# Altium schematic sheet MCU.SchDoc
size A4; SheetNumber: 2; SheetTotal: 6
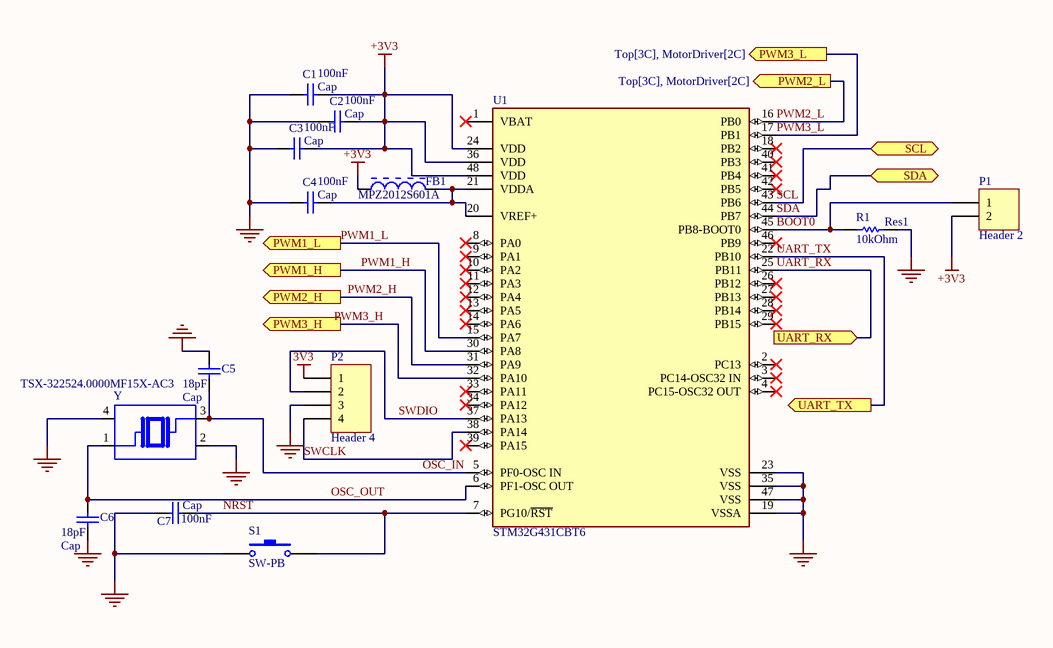
[diagram p0: MCU.SchDoc]

## Parts
C1  Cap  value 100nF  [RAD-0.3]
C2  Cap  value 100nF  [RAD-0.3]
C3  Cap  value 100nF  [RAD-0.3]
C4  Cap  value 100nF  [RAD-0.3]
C5  Cap  value 18pF  [RAD-0.3]
C6  Cap  value 18pF  [RAD-0.3]
C7  Cap  value 100nF  [RAD-0.3]
FB1  MPZ2012S601A  [TDK-MPZ2012_V]
P1  Header 2  [HDR1X2]
P2  Header 4  [HDR1X4]
R1  Res1  value 10kOhm  [AXIAL-0.3]
S1  SW-PB  [SPST-2]
U1  STM32G431CBT6  [FP-LQFP48-5B-MFG]
Y  TSX-322524.0000MF15X-AC3  [OSCCC320X250X60]

## Ports
PWM1_H (out, see Top[3C], MotorDriver[2B]), PWM1_L (out, see Top[3C], MotorDriver[2C]), PWM2_H (out, see Top[3C], MotorDriver[2C]), PWM2_L (out, see Top[3C], MotorDriver[2C]), PWM3_H (out, see Top[3C], MotorDriver[2C]), PWM3_L (out, see Top[3C], MotorDriver[2C]), SCL (bidir, see Top[5B], IMU[1B]), SDA (bidir, see Top[5B], IMU[1B]), UART_RX (in, see Top[6C], Connectors[3C]), UART_TX (out, see Top[6C], Connectors[3B])

## Nets
3V3: P2.1
+3V3: C1.2 C2.2 C3.2 FB1.1 P1.2 U1.24(VDD) U1.36(VDD) U1.48(VDD)
NetC1_1: C1.1 C2.1 C3.1 C4.1 C5.2 C6.1 C7.1 P2.3 R1.2 S1.1 U1.19(VSSA) U1.23(VSS) U1.35(VSS) U1.47(VSS) Y.2 Y.4
BOOT0: P1.1 R1.1 U1.45(PB8-BOOT0)
NRST: C7.2 S1.2 U1.7(PG10/~{RST})
OSC_IN: C5.1 U1.5(PF0-OSC_IN) Y.3
OSC_OUT: C6.2 U1.6(PF1-OSC_OUT) Y.1
PWM1_H: U1.30(PA8) ; port PWM1_H
PWM1_L: U1.15(PA7) ; port PWM1_L
PWM2_H: U1.31(PA9) ; port PWM2_H
PWM2_L: U1.16(PB0) ; port PWM2_L
PWM3_H: U1.32(PA10) ; port PWM3_H
PWM3_L: U1.17(PB1) ; port PWM3_L
SCL: U1.43(PB6) ; port SCL
SDA: U1.44(PB7) ; port SDA
SWCLK: P2.4 U1.38(PA14)
SWDIO: P2.2 U1.37(PA13)
UART_RX: U1.25(PB11) ; port UART_RX
UART_TX: U1.22(PB10) ; port UART_TX
NetC4_2: C4.2 FB1.2 U1.20(VREF+) U1.21(VDDA)

Not connected (* = marked no-connect by the designer): U1 1(VBAT)* 2(PC13)* 3(PC14-OSC32_IN)* 4(PC15-OSC32_OUT)* 8(PA0)* 9(PA1)* 10(PA2)* 11(PA3)* 12(PA4)* 13(PA5)* 14(PA6)* 18(PB2)* 26(PB12)* 27(PB13)* 28(PB14)* 29(PB15)* 33(PA11)* 34(PA12)* 39(PA15)* 40(PB3)* 41(PB4)* 42(PB5)* 46(PB9)*

## Library data of the parts
C1-C7 = Cap: Capacitor; Published: 8-Jun-2000; LatestRevisionDate: 17-Jul-2002; LatestRevisionNote: Re-released for DXP Platform.; PackageReference: RAD-0.3; Publisher: Altium Limited; PackageDescription: Radial Cap, Thru-Hole; 2 Leads; 0.3 in Pin Spacing
FB1 = CMP-2000-05400-1: Chip Bead for Power Line, 600 Ohm, +/- 25%, 2 A, -55 to 125 degC, 2-Pin SMD (0805), RoHS, Tape and Reel; Manufacturer: TDK; Maximum DC Current: 2A; Impedance: 600Ohms; Test Frequency: 100MHz; Case Length: 2mm; Maximum DC Resistance: 100mOhms; Case Height: 0.85mm; Case Width: 1.25mm; Factory Pack Quantity: 4000; Operating Temperature Range: -55Cto+125C; Packaging: Reel; Datasheet URL: https://datasheet.ciiva.com/23763/1750041-23763249.pdf; Manufacturer URL: http://www.tdk.com/; Product Category: EMIFilterBeads,Chips&Arrays; Tolerance: 25%; Product: FerriteChipBeads; Package / Case: 0805(2012metric); RoHS: Details; Dimensions: 1.25mmWx2mmLx0.85mmH; Datasheet Version: Jul-13; Termination Style: SMD/SMT; Package Reference: 805; Brand: TDK; Package Description: 2-Pin Surface Mount Device, Body 2 x 1.25 mm
P1 = Header 2: Header, 2-Pin; LatestRevisionDate: 17-Jul-2002; LatestRevisionNote: Re-released for DXP Platform.; Publisher: Altium Limited
P2 = Header 4: Header, 4-Pin; LatestRevisionDate: 17-Jul-2002; LatestRevisionNote: Re-released for DXP Platform.; Publisher: Altium Limited
R1 = Res1: Resistor; Published: 8-Jun-2000; LatestRevisionDate: 17-Jul-2002; LatestRevisionNote: Re-released for DXP Platform.; PackageReference: AXIAL-0.3; Publisher: Altium Limited; PackageDescription: Axial Device, Thru-Hole; 2 Leads; 0.3 in Pin Spacing
S1 = SW-PB: Switch; Published: 24-Mar-1999; LatestRevisionDate: 17-Jul-2002; LatestRevisionNote: Re-released for DXP Platform.; PackageReference: SPST-2; Publisher: Altium Limited; PackageDescription: Switch; 2 Leads
U1 = CMP-12105-000030-1: MAINSTREAM ARM CORTEX-M4+ MCU 17; Manufacturer: STMicroelectronics; Number Of Adc Channels: 17; Number Of I/Os: 38; Standoff Height: 0.05mm; Number Of Usb Channels: 1; Data Bus Width: 32bits; Number Of I2C Channels: 3; Number Of Pwm Channels: 31; Frequency: 170MHz; Memory Type: FLASH; Number Of Timers/Counters: 14; Ram Size: 32KBytes; Max Junction Temp: +105°C; Memory Size: 128KBytes; Min Supply Voltage: 1.62V; Description: ARM® Cortex®-M4F STM32G4 Microcontroller IC 32-Bit 170MHz 128KB (128K x 8) FLASH 48-LQFP (7x7); Max Supply Voltage: 3.6V; Number Of Uart Channels: 4; Interface: I2C,SPI,UART,USART,CAN,USB,LIN,IrDA,I2S; Temperature Range Low: -40°C; Lead Free: Yes; Device Class L3: Microcontrollers; Number Of Cores: 1; Temperature Range High: +85°C; Height: 1.6mm; Digikey Description: MAINSTREAM ARM CORTEX-M4+ MCU 17; Device Class L1: Integrated Circuits (ICs); Package: LQFP48-5B; RoHS: TRUE; Number Of A/D Converters: 1; Core Architecture: Arm Cortex-M4; Device Class L2: Embedded Processors and Controllers; ComponentLink2Description: Datasheet; Temperature: -40°C to +85°C; Ambient Temperature Range High: +85°C; Ambient Temperature Range Low: -40°C; Octopart: https://octopart.com/stm32g431cbt6-stmicroelectronics-98835224; ComponentLink2URL: https://www.st.com/resource/en/datasheet/stm32g431cb.pdf; Automotive: No; Number Of Spi Channels: 3; Manufacturer Part Number: STM32G431CBT6; Category: IC
Y = TSX-322524.0000MF15X-AC3: 24MHz Â±10ppm Crystal 9pF 40 Ohms 4-SMD, No Lead; MF: EPSON; Availability: Unavailable; Value: *; Package: SMD-4 EPSON; Price: None; SnapEDA_Link: https://www.snapeda.com/parts/TSX-3225%2024.0000MF15X-AC3/EPSON/view-part/230042/?ref=snap; MP: TSX-3225 24.0000MF15X-AC3